# EasyEDA schematic sierpinski-tree_2020-12-05_14-07-16.json

## Sheets
1 Sheet_1: TITLE: Sheet_1; REV: 1.0; Date: 2020-12-05; Sheet: 1/1; Drawn By: mrsimicsak; Company: Your Company
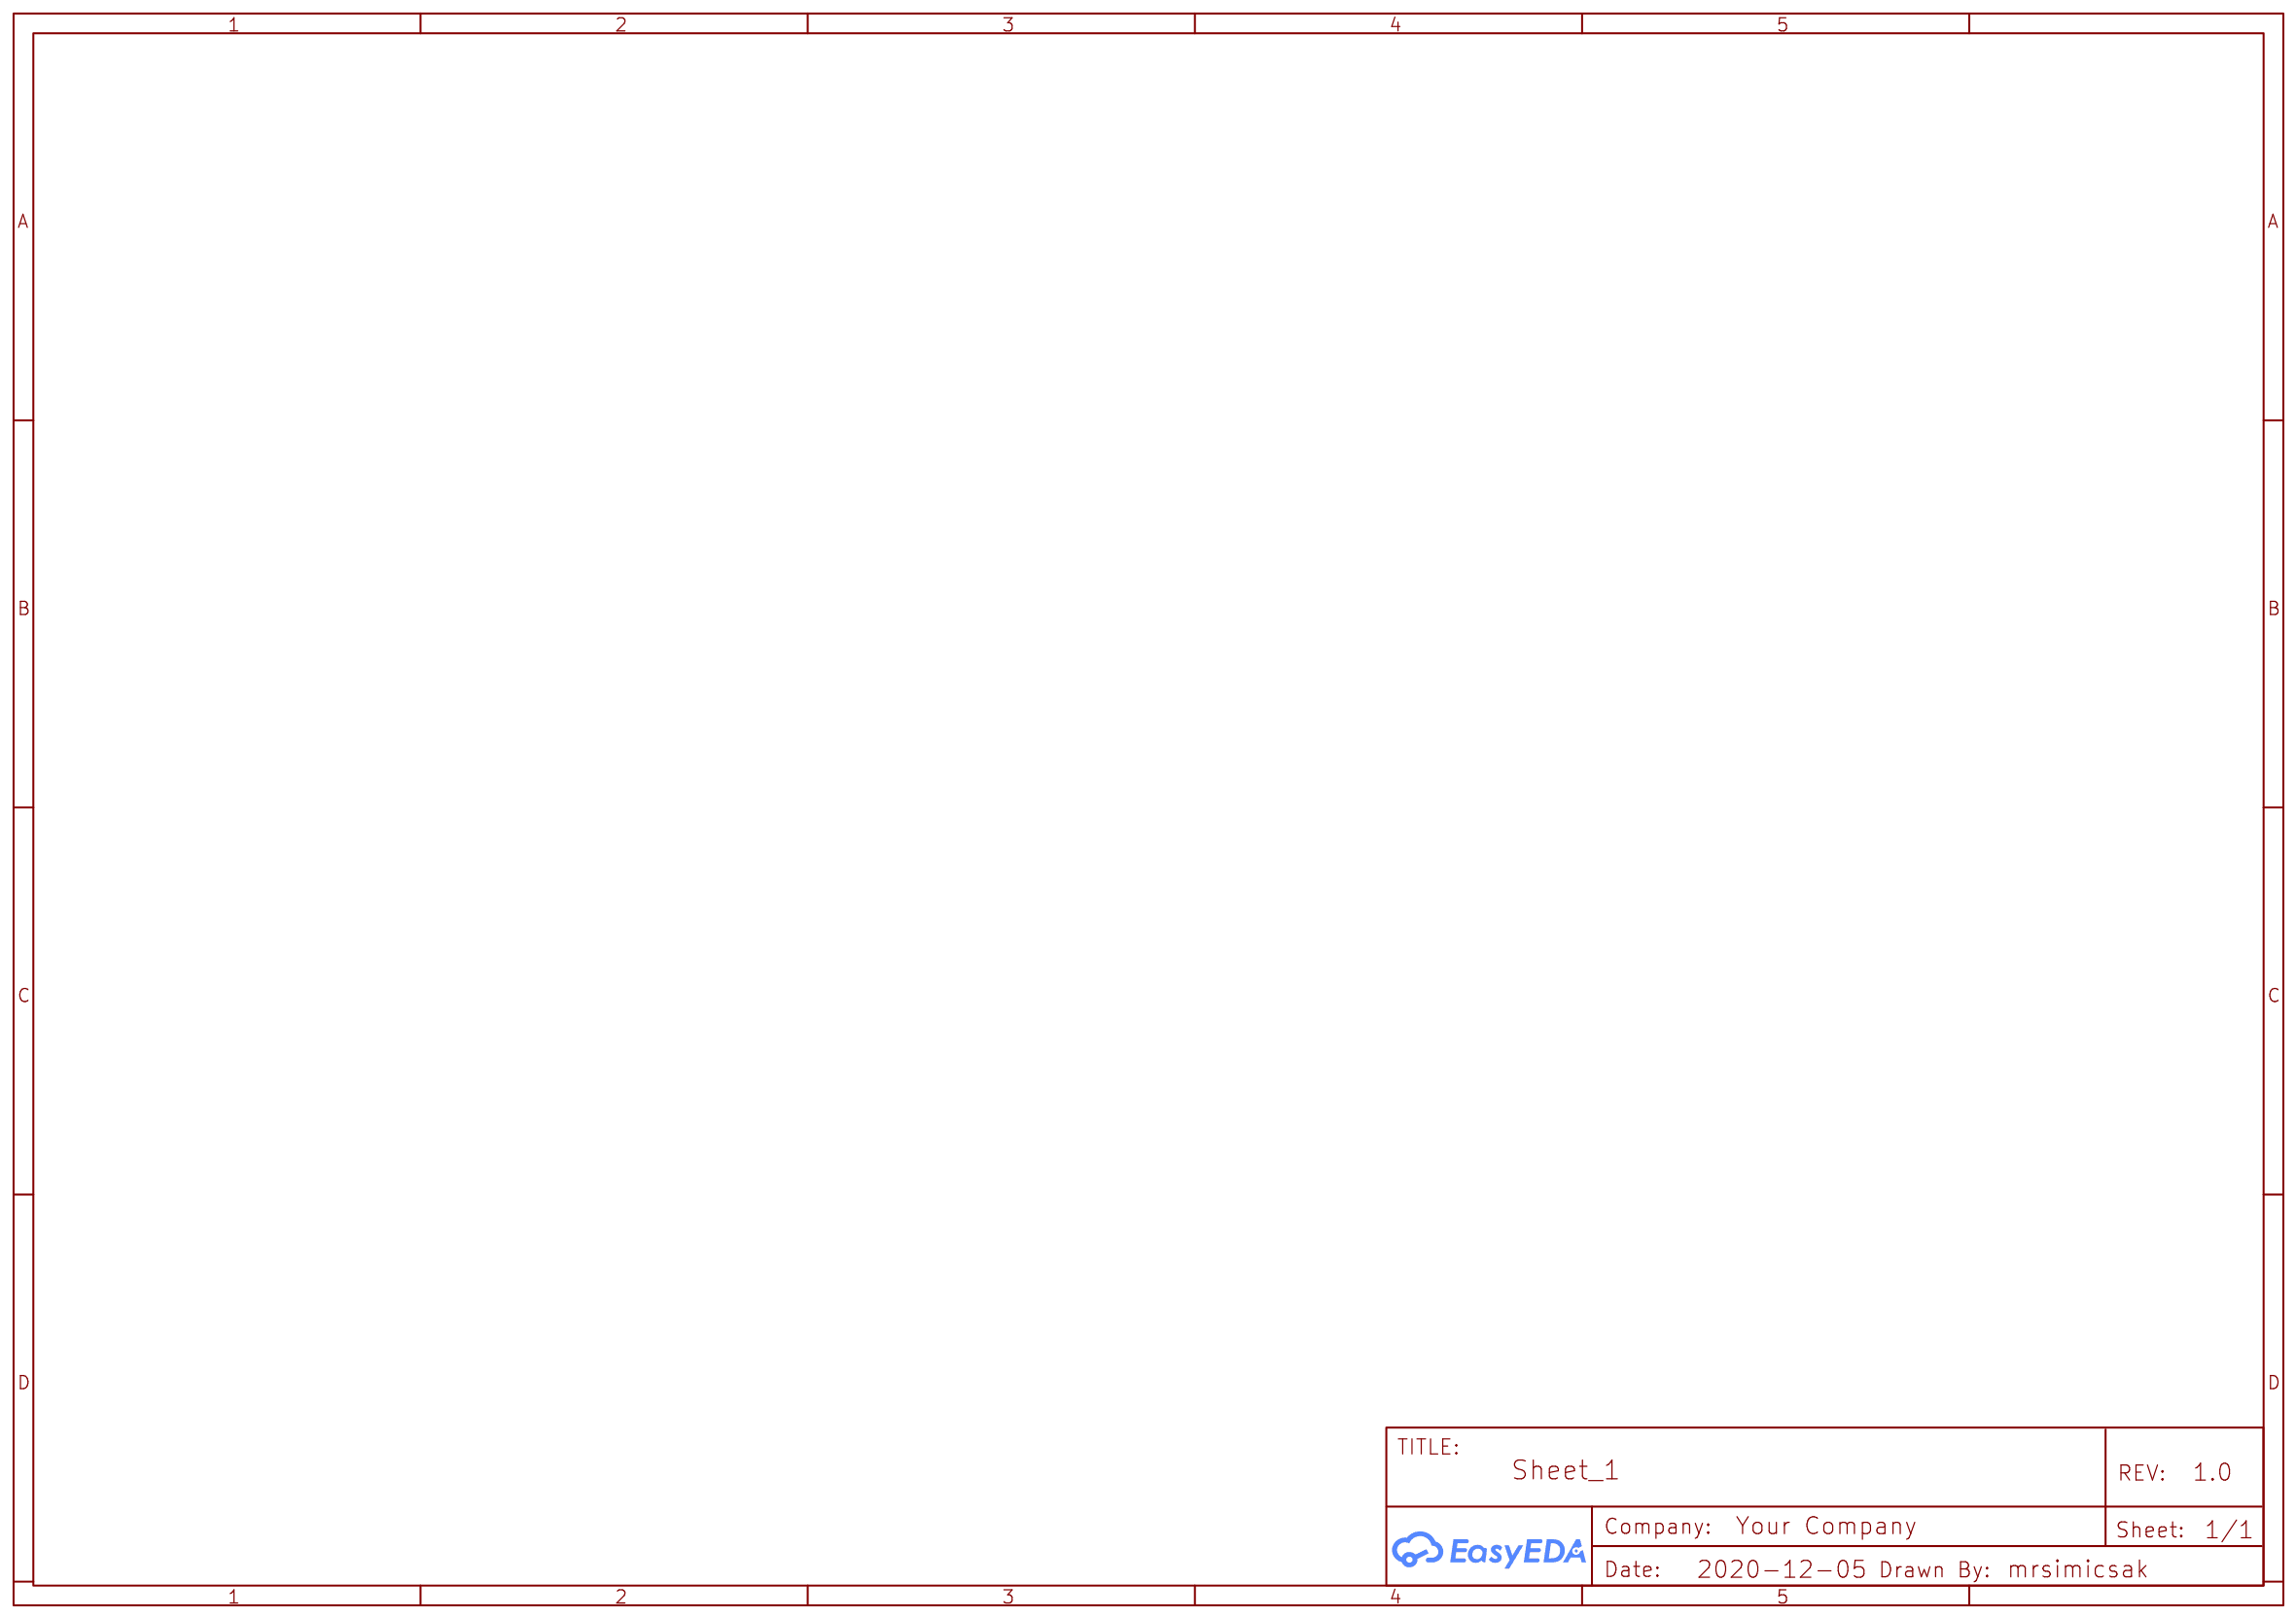
[diagram p0: Sheet_1]
2 Sheet_1#2: TITLE: Siperinski Christmas Tree; Date: 2020-11-14; Drawn By: Landon Carter; Company: Landon Carter
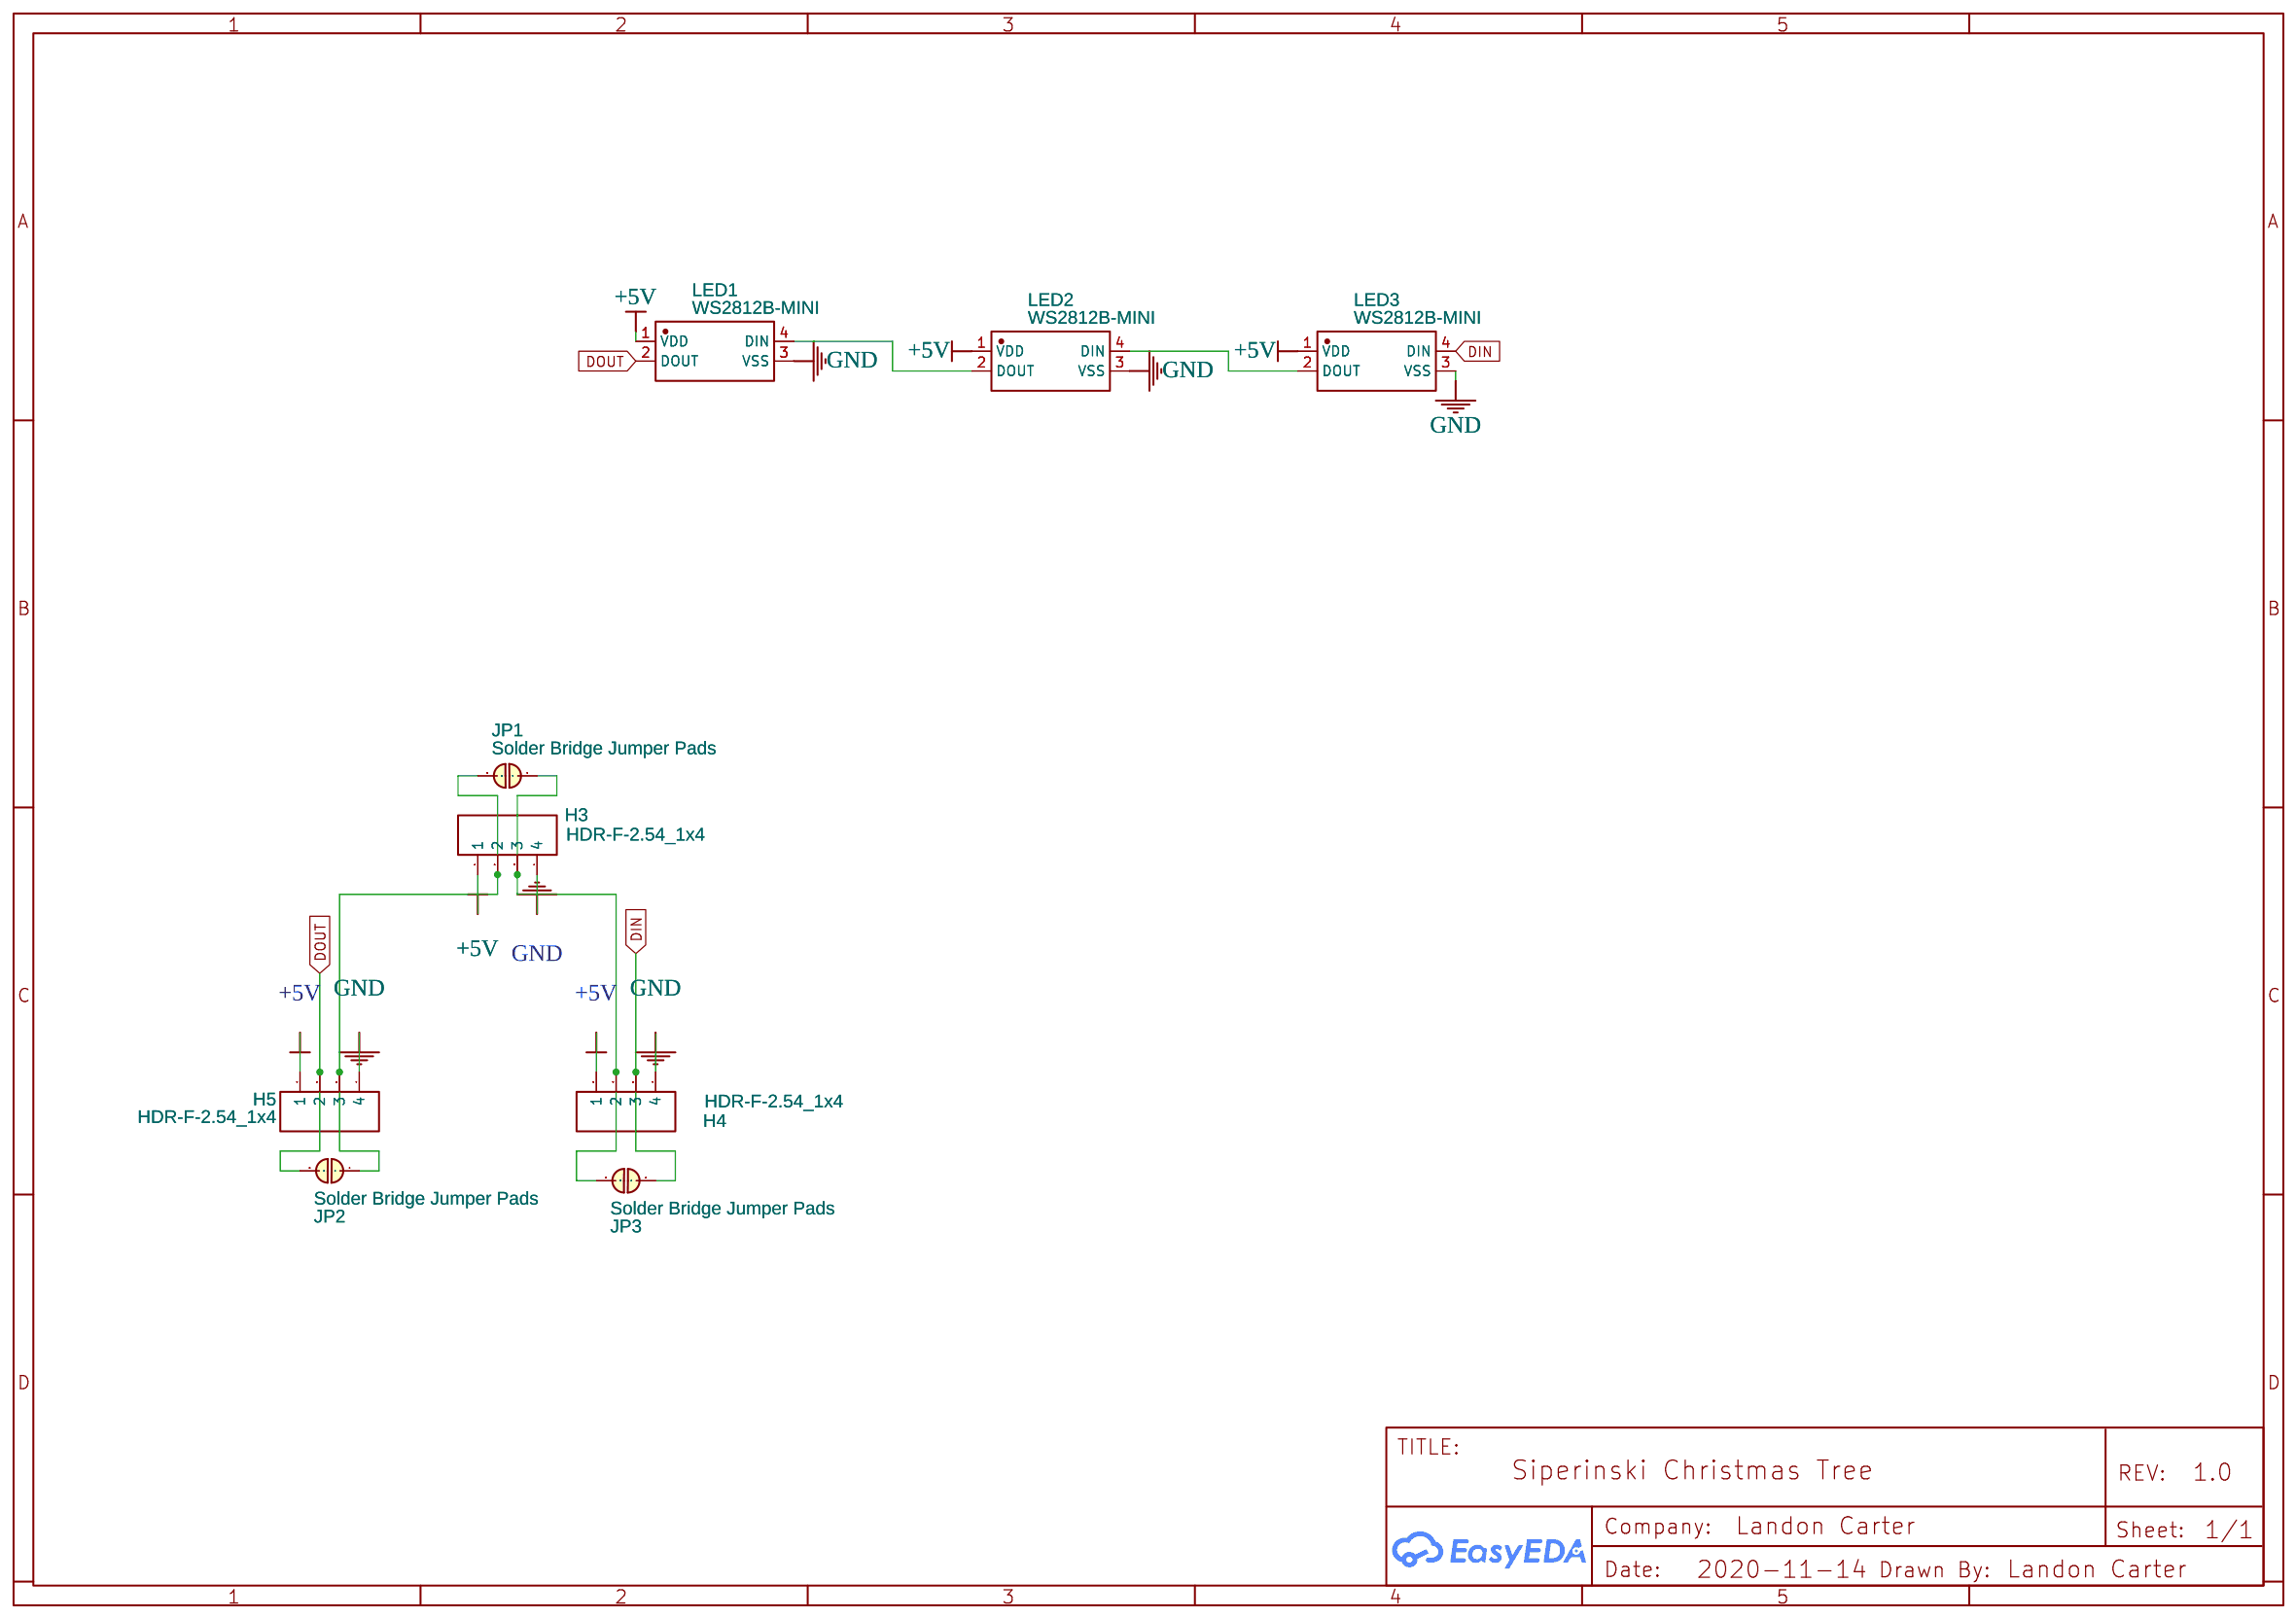
[diagram p1: Sheet_1#2]

## Parts
H3  HDR-F-2.54_1x4  [HDR-F-2.54_1X4]
H4  HDR-F-2.54_1x4  [HDR-F-2.54_1X4]
H5  HDR-F-2.54_1x4  [HDR-F-2.54_1X4]
JP1  Solder Bridge Jumper Pads  [SOLDER BRIDGE JUMPER PADS]
JP2  Solder Bridge Jumper Pads  [SOLDER BRIDGE JUMPER PADS]
JP3  Solder Bridge Jumper Pads  [SOLDER BRIDGE JUMPER PADS]
LED1  WS2812B-MINI  [LED-SMD_4P-L3.5-W3.5-TL_WS2812B]
LED2  WS2812B-MINI  [LED-SMD_4P-L3.5-W3.5-TL_WS2812B]
LED3  WS2812B-MINI  [LED-SMD_4P-L3.5-W3.5-TL_WS2812B]

## Library data of the parts
H3-H5 = HDR-F-2.54_1x4: Supplier Part: C225501; Supplier: LCSC; Contributor: LCEDA_Lib
JP1-JP3 = Solder Bridge Jumper Pads: Contributor: Sam G
LED1-LED3 = WS2812B-MINI: Supplier: LCSC; Supplier Part: C527089; Manufacturer: Worldsemi; Manufacturer Part: WS2812B-Mini; Contributor: LCSC; LCSC Assembly: Yes; SMT Type: Extend

## Nets
+5V: H3.1 H4.1 H5.1 LED1.1(VDD) LED2.1(VDD) LED3.1(VDD)
GND: H3.4 H4.4 H5.4 LED1.3(VSS) LED2.3(VSS) LED3.3(VSS)
DIN: H4.3 JP3.1 LED3.4(DIN)
DOUT: H5.2 JP2.2 LED1.2(DOUT)
Net-(H3-2): H3.2 H5.3 JP1.2 JP2.1
Net-(H3-3): H3.3 H4.2 JP1.1 JP3.2
Net-(LED1-4): LED1.4(DIN) LED2.2(DOUT)
Net-(LED2-4): LED2.4(DIN) LED3.2(DOUT)
